# EAGLE schematic h2oiq (EAGLE 6.3)
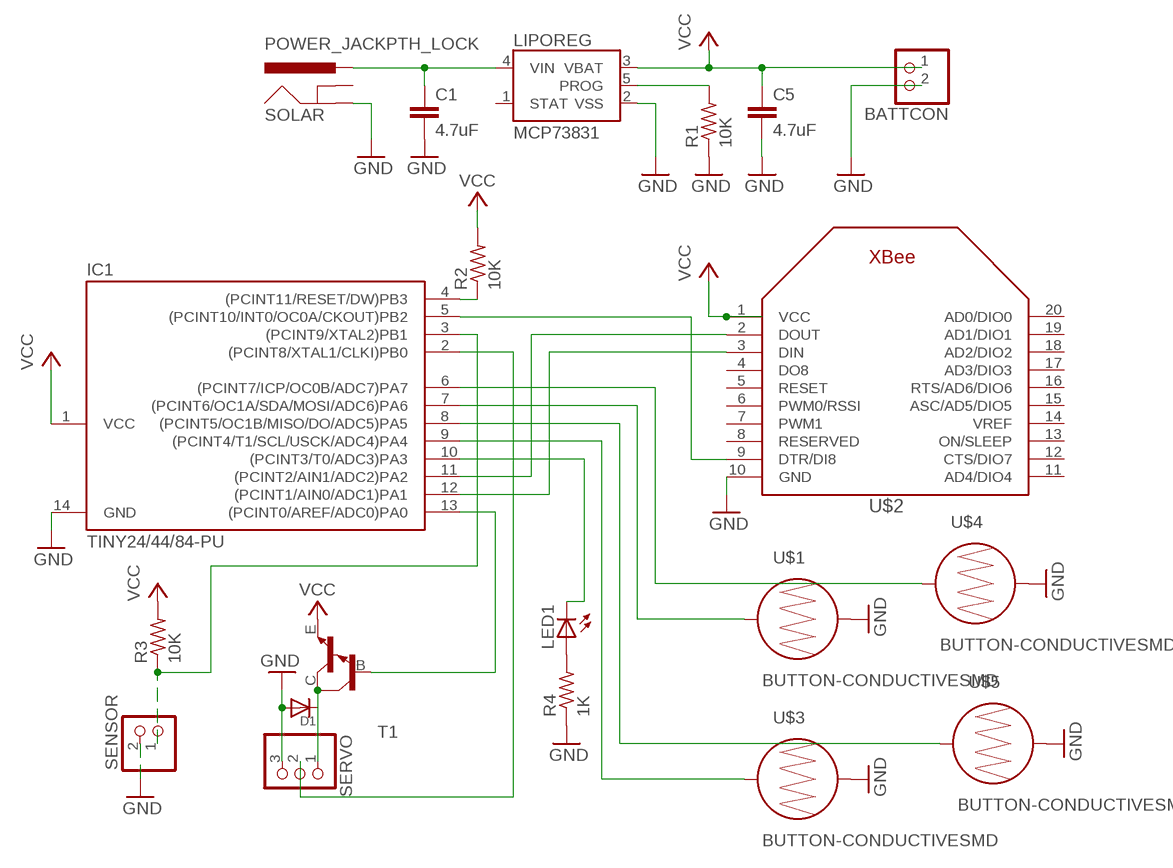
[diagram p0: schematic, sheet 1]

## Parts
BATTCON  JST_2PIN-SMT  [JST-PH-2-SMT]
C1  4.7uF  CAP0402-CAP  [0402-CAP]
C5  4.7uF  CAP0402-CAP  [0402-CAP]
D1  DIODESMA  [SMADIODE]
IC1  TINY24/44/84-PU  [DIL14]
LED1  LED5MM  [LED5MM]
LIPOREG  MCP73831  [SOT23-5]
R1  10K  R-US_M1206  [M1206]
R2  10K  R-US_M1206  [M1206]
R3  10K  R-US_M1206  [M1206]
R4  1K  R-US_M1206  [M1206]
SENSOR  JST_2PIN-SMT  [JST-PH-2-SMT]
SERVO  PINHD-1X3CB  [1X03-CLEANBIG]
SOLAR  POWER_JACKPTH_LOCK  [POWER_JACK_PTH_LOCK]
T1  MMBTA13LT1-NPN_DARL-SOT23-BEC  [SOT23-BEC]
U$1  BUTTON-CONDUCTIVESMD  [BUTTON-CONDUCTIVE]
U$2  XBEE  [XBEE]
U$3  BUTTON-CONDUCTIVESMD  [BUTTON-CONDUCTIVE]
U$4  BUTTON-CONDUCTIVESMD  [BUTTON-CONDUCTIVE]
U$5  BUTTON-CONDUCTIVESMD  [BUTTON-CONDUCTIVE]

## Nets
GND: BATTCON.2 C1.2 C5.2 D1.A IC1.14(GND) LIPOREG.2(VSS) R1.1 R4.1 SENSOR.2 SERVO.3 SOLAR.GND U$1.2 U$2.10(GND) U$3.2 U$4.2 U$5.2
N$1: C1.1 LIPOREG.4(VIN) SOLAR.PWR
N$2: LIPOREG.5(PROG) R1.2
N$3: IC1.4((PCINT11/RESET/DW)PB3) R2.1
N$4: IC1.13((PCINT0/AREF/ADC0)PA0) T1.B
N$5: D1.C SERVO.1 T1.C
N$6: IC1.5((PCINT10/INT0/OC0A/CKOUT)PB2) U$2.9(DTR/DI8)
N$7: IC1.11((PCINT2/AIN1/ADC2)PA2) U$2.2(DOUT)
N$8: IC1.12((PCINT1/AIN0/ADC1)PA1) U$2.3(DIN)
N$9: IC1.3((PCINT9/XTAL2)PB1) R3.1 SENSOR.1
N$10: IC1.2((PCINT8/XTAL1/CLKI)PB0) SERVO.2
N$11: LED1.A R4.2
N$12: IC1.10((PCINT3/T0/ADC3)PA3) LED1.K(C)
N$18: IC1.7((PCINT6/OC1A/SDA/MOSI/ADC6)PA6) U$1.1
N$19: IC1.6((PCINT7/ICP/OC0B/ADC7)PA7) U$4.1
N$20: IC1.8((PCINT5/OC1B/MISO/DO/ADC5)PA5) U$5.1
N$21: IC1.9((PCINT4/T1/SCL/USCK/ADC4)PA4) U$3.1
VCC: BATTCON.1 C5.1 IC1.1(VCC) LIPOREG.3(VBAT) R2.2 R3.2 T1.E U$2.1(VCC)
Unconnected: LIPOREG.1(STAT) SOLAR.GNDBREAK U$2.4(DO8) U$2.5(RESET) U$2.6(PWM0/RSSI) U$2.7(PWM1) U$2.8(RESERVED) U$2.11(AD4/DIO4) U$2.12(CTS/DIO7) U$2.13(ON/SLEEP) U$2.14(VREF) U$2.15(ASC/AD5/DIO5) U$2.16(RTS/AD6/DIO6) U$2.17(AD3/DIO3) U$2.18(AD2/DIO2) U$2.19(AD1/DIO1) U$2.20(AD0/DIO0)

## Library data of the parts
BATTCON SENSOR = adafruit:JST_2PIN: JST 2-Pin Connectors of various flavors SMT-RA (S2B-PH-SM4) 4UConnector #17311 SMT (B2B-PH-SM4) THM-RA (S2B-PH) THM (B2B-PH)
C1 C5 = SparkFun:CAP: Capacitor Standard 0603 ceramic capacitor, and 0.1" leaded capacitor.
D1 = adafruit:DIODE: Diode SMADIODE - SMA Surface Mount Package 20V 1A Schottky Diode Digikey: 641-1014-6-ND DO-1N4148 - Through Hole Small Current Diode SOD-123 20V 1 A (.5mV Vf) Schottky Diode - Digikey: MBRX120TPMSCT-ND SOD-323 10V 570mA (.38mV Vf, 3ns) Schottky Diode - Digikey: ZLLS410CT-ND SOD-523 30V 30mA Schottky Diode (RB751S-40TE61) - Digikey: RB751S-40TE61CT-ND SOT23-R/W - SOT23 Package (R = Solder Paste/Reflow Ovens, W = Hand-Soldering) BAT54Film 40V 300mA - Digikey: 497-7162-1-ND
IC1 = avr-7:TINY24/44/84
LED1 = adafruit:LED: LED OSRAM: - CHIPLED LG R971, LG N971, LY N971, LG Q971, LY Q971, LO R971, LY R971 LH N974, LH R974 LS Q976, LO Q976, LY Q976 LO Q996 - Hyper CHIPLED LW Q18S LB Q993, LB Q99A, LB R99A - SideLED LS A670, LO A670, LY A670, LG A670, LP A670 LB A673, LV A673, LT A673, LW A673 LH A674 LY A675 LS A676, LA A676, LO A676, LY A676, LW A676 LS A679, LY A679, LG A679 - Hyper Micro SIDELED® LS Y876, LA Y876, LO Y876, LY Y876 LT Y87S - SmartLED LW L88C, LW L88S LB L89C, LB L89S, LG L890 LS L89K, LO L89K, LY L89K LS L896, LA L896, LO L896, LY L896 - TOPLED LS T670, LO T670, LY T670, LG T670, LP T670 LSG T670, LSP T670, LSY T670, LOP T670, LYG T670 LG T671, LOG T671, LSG T671 LB T673, LV T673, LT T673, LW T673 LH T674 LS T676, LA T676, LO T676, LY T676, LB T676, LH T676, LSB T676, LW T676 LB T67C, LV T67C, LT T67C, LS T67K, LO T67K, LY T67K, LW E67C LS E67B, LA E67B, LO E67B, LY E67B, LB E67C, LV E67C, LT E67C LW T67C LS T679, LY T679, LG T679 LS T770, LO T770, LY T770, LG T770, LP T770 LB T773, LV T773, LT T773, LW T773 LH T774 LS E675, LA E675, LY E675, LS T675 LS T776, LA T776, LO T776, LY T776, LB T776 LHGB T686 LT T68C, LB T68C - Hyper Mini TOPLED® LB M676 - Mini TOPLED Santana® LG M470 LS M47K, LO M47K, LY M47K Source: http://www.osram.convergy.de/
LIPOREG = SparkFun:MCP73831: Microchip's MCP73831 Miniature single cell, fully integrated Li-Ion, Li-polymer charge management controller http://ww1.microchip.com/downloads/en/DeviceDoc/21984a.pdf
R1-R4 = rcl:R-US_: RESISTOR, American symbol
SERVO = adafruit:PINHD-1X3: PIN HEADER
SOLAR = SparkFun:POWER_JACK: Power Jack This is the standard 5.5mm barrel jack for power. The PTH is the most common, proven, reliable, footprint. All others are experimental. The Slot footprint only works if the mill layer is transmitted to the PCB fab house so be warned. Spark Fun Electronics SKU : PRT-00119. Mating wall wart : TOL-00298 (and others)
T1 = transistor:*-NPN_DARL-: NPN Darlington Transistor
U$1 U$3-U$5 = SparkFun:BUTTON-CONDUCTIVE: Conductive Button Used with rubber key pads. This one was designed and proven to work with the PolyCase Key FOB enclosures.
U$2 = adafruit:XBEE